# Altium schematic sheet [0]- Block Diagram.SchDoc: RK3399 SOM Board Design V1.0
size A4; Author: AVIRAL MISHRA; SheetNumber: 1; SheetTotal: 1; PROJECT CODE: A_V1.0
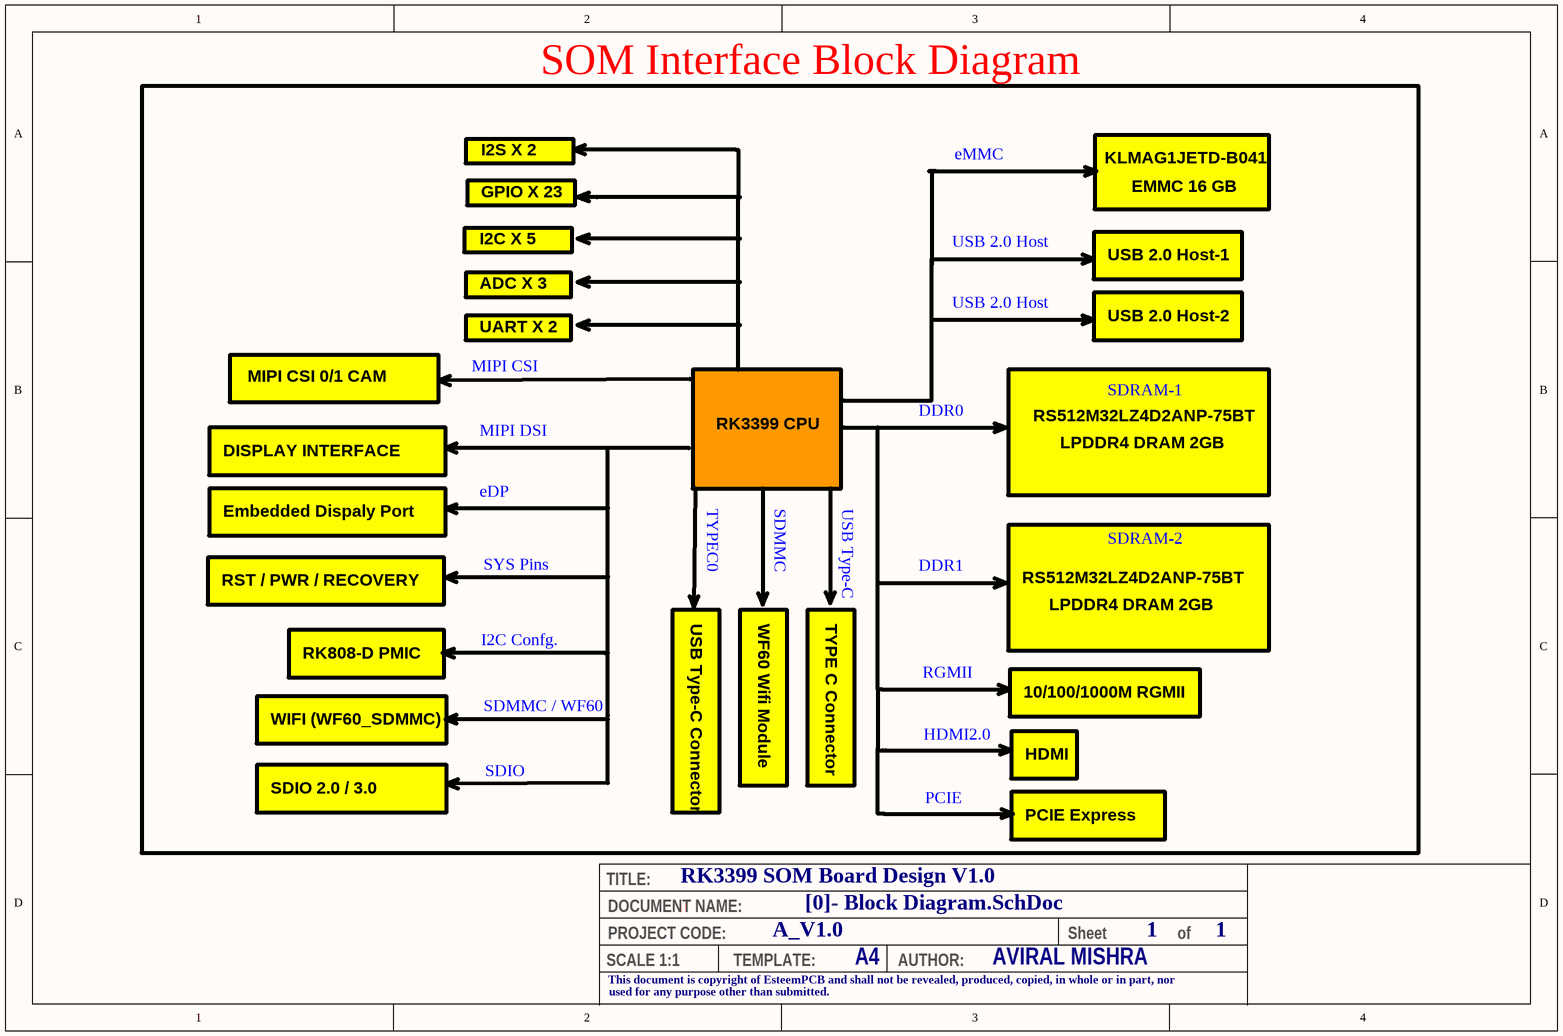
[diagram p0: [0]- Block Diagram.SchDoc]

## Notes on the sheet
- SOM Interface Block Diagram
- I2S X 2
- eMMC
- KLMAG1JETD-B041
- I2C X 5
- GPIO X 23
- USB 2.0 Host
- EMMC 16 GB
- ADC X 3
- USB 2.0 Host-1
- MIPI CSI 0/1 CAM
- MIPI CSI
- UART X 2
- USB 2.0 Host-2
- MIPI DSI
- RK3399 CPU
- DDR0
- RS512M32LZ4D2ANP-75BT
- LPDDR4 DRAM 2GB
- SDRAM-1
- DISPLAY INTERFACE
- Embedded Dispaly Port
- eDP
- TYPEC0
- SDMMC
- USB Type-C
- RST / PWR / RECOVERY
- SYS Pins
- DDR1
- SDRAM-2
- I2C Confg.
- USB Type-C Connector
- WF60 Wifi Module
- TYPE C Connector
- RK808-D PMIC
- SDMMC / WF60
- RGMII
- 10/100/1000M RGMII
- WIFI (WF60_SDMMC)
- SDIO
- HDMI2.0
- HDMI
- SDIO 2.0 / 3.0
- PCIE
- PCIE Express
- TITLE:
- DOCUMENT NAME:
- SCALE 1:1
- This document is copyright of EsteemPCB and shall not be revealed, produced, copied, in whole or in part, nor
- PROJECT CODE:
- TEMPLATE:
- A4
- AUTHOR:
- Sheet
- of
- used for any purpose other than submitted.